# EAGLE design lego_air_quality (EAGLE 6.6.0)
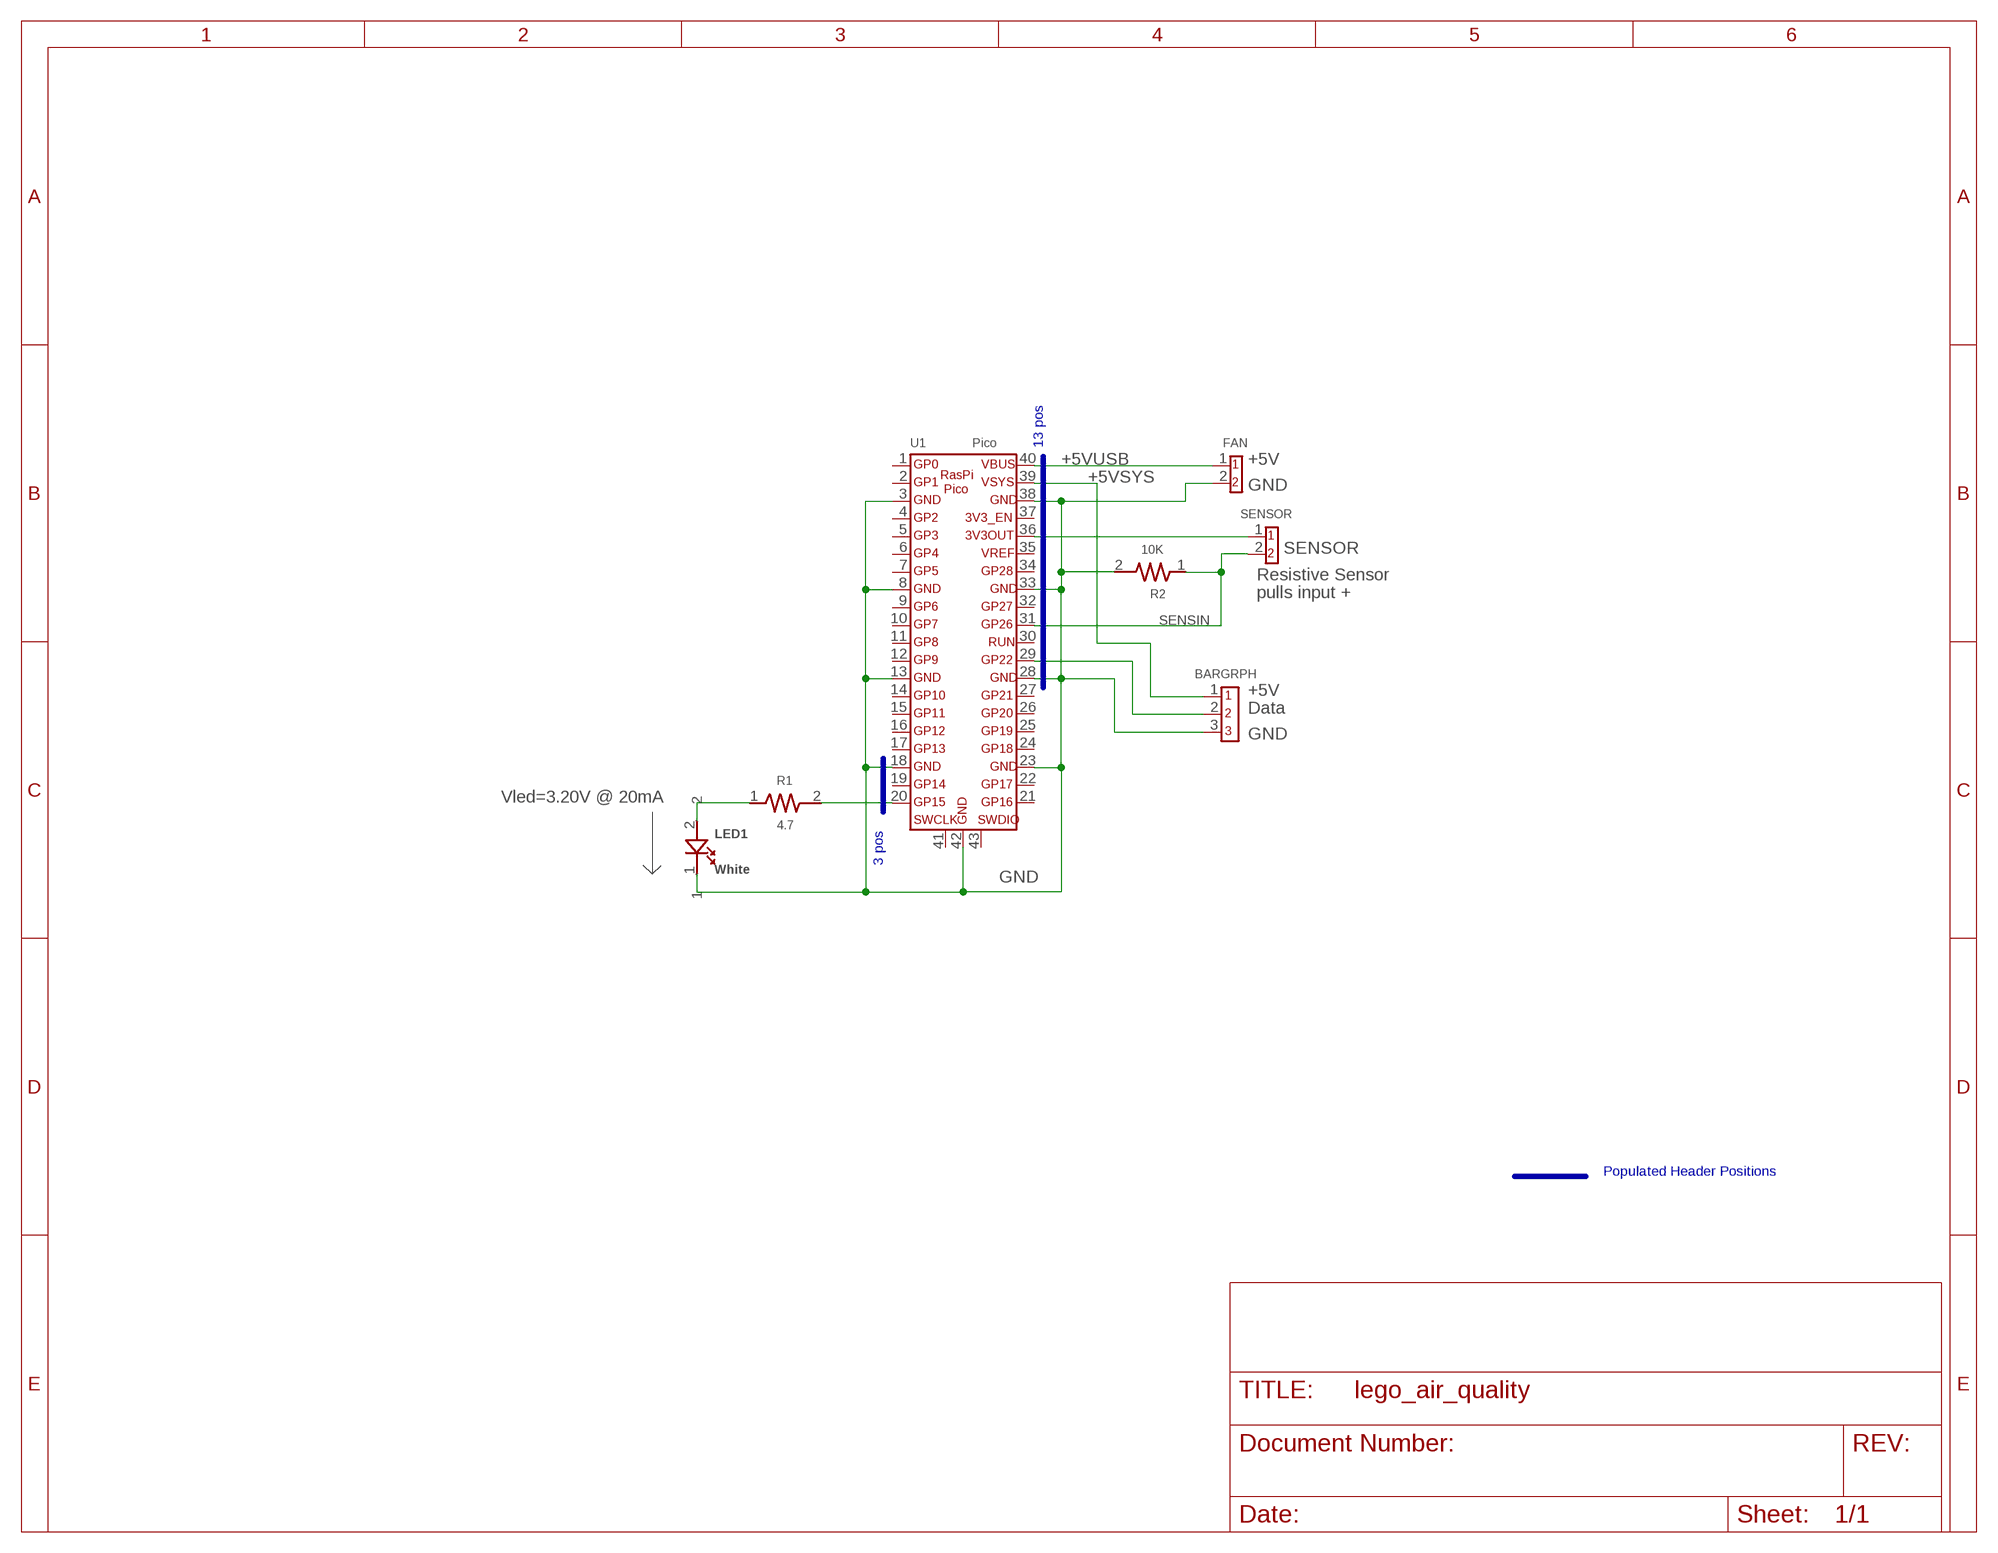
[diagram p0: schematic, sheet 1]

## Parts
BARGRPH  3PINBERG  [3PINBERG]
FAN  2PINBERG  [2PINBERG]
LED1  White  LED5MM  [LED5MM]
R1  4.7  R0_25W  [R0_25W]
R2  10K  R0_25W  [R0_25W]
SENSOR  2PINBERG  [2PINBERG]
U1  Pico  RASPIPICO  [RASPIPICO]

## Nets
+5VSYS: BARGRPH.1 U1.39
+5VUSB: FAN.1 U1.40
GND: BARGRPH.3 FAN.2 LED1.1 R2.2 U1.3 U1.8 U1.13 U1.18 U1.23 U1.28 U1.33 U1.38 U1.42
N$1: R1.2 U1.20
N$2: LED1.2 R1.1
N$3: SENSOR.1 U1.36
N$9: BARGRPH.2 U1.29
SENSIN: R2.1 SENSOR.2 U1.31
Unconnected: U1.1 U1.2 U1.4 U1.5 U1.6 U1.7 U1.9 U1.10 U1.11 U1.12 U1.14 U1.15 U1.16 U1.17 U1.19 U1.21 U1.22 U1.24 U1.25 U1.26 U1.27 U1.30 U1.32 U1.34 U1.35 U1.37 U1.41 U1.43

## Buses
B$1
B$2
B$3

## Notes on the sheet
- 13 pos
- +5V
- GND
- SENSOR
- Resistive Sensor
- pulls input +
- +5V
- Data
- GND
- Vled=3.20V @ 20mA
- 3 pos
- Populated Header Positions

## Library data of the parts
BARGRPH = JCGCustom:3PINBERG
FAN SENSOR = JCGCustom:2PINBERG
LED1 = JCGCustom:LED5MM: 5mm or T 1 3/4 Std PTH LED
R1 R2 = JCGCustom:R0_25W
U1 = JCGCustom:RASPIPICO: Raspberry Pi PICO / PICO W

## Board
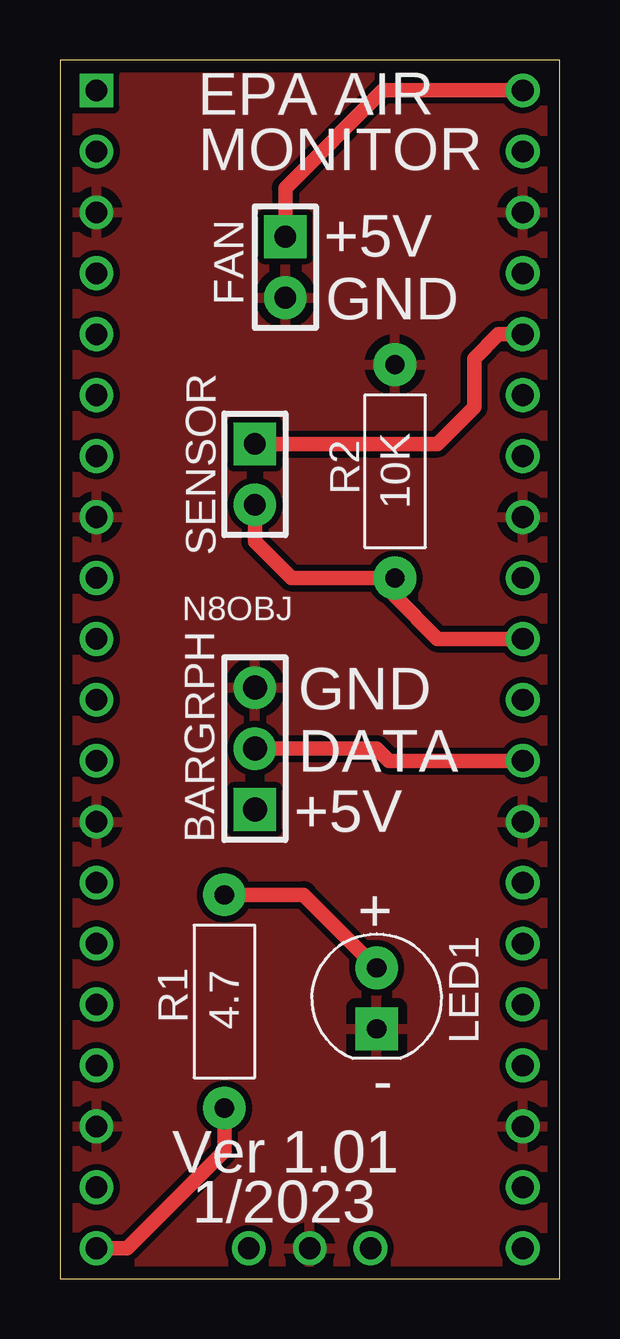
[diagram p1: board, top side]
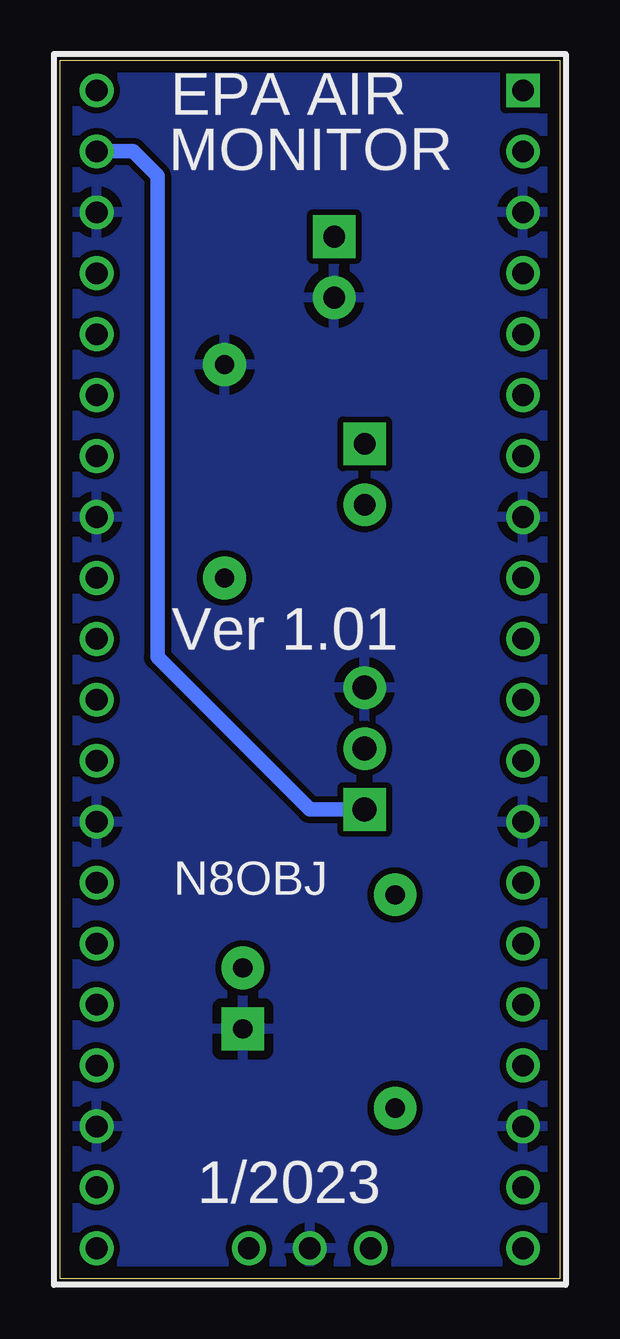
[diagram p2: board, bottom side, seen from below]

Size 20.83 x 50.8 mm. Coordinates in mm from the lower left corner, seen from the top.
Outline: 0,0 20.83,0 20.83,50.8 0,50.8 0,0
Copper layers (1*16): Top 0.035mm / dielectric 1.5mm / Bottom 0.035mm
Design rules "default *": minimum track width 10mil, minimum drill 24mil, track to track 10mil, track to pad 10mil, pad to pad 10mil, via to via 10mil, smd to smd 10mil, copper to edge 20mil, drill to drill 10mil, minimum pad ring 10mil, minimum via ring 8mil, stop-mask expansion 4mil, vias tented up to drill 0mil, thermal gap 15mil

### Footprints (pad centres in the part's own frame; a part is rotated, then mirrored left to right if it is on the bottom)
3PINBERG = drill 1 pad 1.778 square: 1 0,2.54 | drill 1 pad 1.778: 2 0,0; 3 0,-2.54
2PINBERG = drill 0.9 pad 1.778 square: 1 0,1.27 | drill 0.9 pad 1.778: 2 0,-1.27
LED5MM = drill 0.8 pad 1.778 square: 1 1.27,0 | drill 0.8 pad 1.778: 2 -1.27,0
R0_25W = drill 0.8 pad 1.778: 1 3.81,0; 2 -5.08,0
RASPIPICO = drill 0.9 square: 1 -8.89,23.368 | drill 0.9: 2 -8.89,20.828; 3 -8.89,18.288; 4 -8.89,15.748; 5 -8.89,13.208; 6 -8.89,10.668; 7 -8.89,8.128; 8 -8.89,5.588; 9 -8.89,3.048; 10 -8.89,0.508; 11 -8.89,-2.032; 12 -8.89,-4.572; 13 -8.89,-7.112; 14 -8.89,-9.652; 15 -8.89,-12.192; 16 -8.89,-14.732; 17 -8.89,-17.272; 18 -8.89,-19.812; 19 -8.89,-22.352; 20 -8.89,-24.892; 21 8.89,-24.892; 22 8.89,-22.352; 23 8.89,-19.812; 24 8.89,-17.272; 25 8.89,-14.732; 26 8.89,-12.192; 27 8.89,-9.652; 28 8.89,-7.112; 29 8.89,-4.572; 30 8.89,-2.032; 31 8.89,0.508; 32 8.89,3.048; 33 8.89,5.588; 34 8.89,8.128; 35 8.89,10.668; 36 8.89,13.208; 37 8.89,15.748; 38 8.89,18.288; 39 8.89,20.828; 40 8.89,23.368; 41 -2.54,-24.892; 42 0,-24.892; 43 2.54,-24.892

### Placement (x,y rotation side)
BARGRPH  8.13,22.1 180 top
FAN  9.4,42.16 0 top
LED1  13.21,11.68 270 top
R1  6.86,12.19 90 top
R2  13.97,33.02 270 top
SENSOR  8.13,33.53 0 top
U1  10.41,26.16 0 top

### Tracks (layer width: path | path; a pad name or v marks a point on that pad's centre or on a via)
+5VSYS
  Bottom 0.61: U1.39 17.78,46.99 16.76,45.97 16.76,25.91 10.41,19.56 BARGRPH.1
+5VUSB
  Top 0.61: U1.40 13.46,49.53 9.4,45.47 FAN.1
GND
  pour Bottom: 0.25,50.55 20.57,50.55 20.57,0.25 0.25,0.25
  pour Top: 0.25,50.55 20.57,50.55 20.57,0.25 0.25,0.25
N$1
  Top 0.61: U1.20 2.79,1.27 6.86,5.33 R1.2
N$2
  Top 0.61: R1.1 10.16,16 LED1.2
N$3
  Top 0.61: SENSOR.1 15.75,34.8 17.27,36.32 17.27,38.35 18.29,39.37 U1.36
N$9
  Top 0.61: BARGRPH.2 13.21,22.1 13.72,21.59 U1.29
SENSIN
  Top 0.61: SENSOR.2 8.13,30.73 9.65,29.21 R2.1 13.97,28.45 15.75,26.67 U1.31

### Text on the board
tPlace: EPA AIR | MONITOR | +5V | GND | 10K | N8OBJ | GND | DATA | +5V | + | 4.7 | - | Ver 1.01 | 1/2023
bPlace: EPA AIR | MONITOR | Ver 1.01 | N8OBJ | 1/2023